# Altium project hermes.PrjPcb
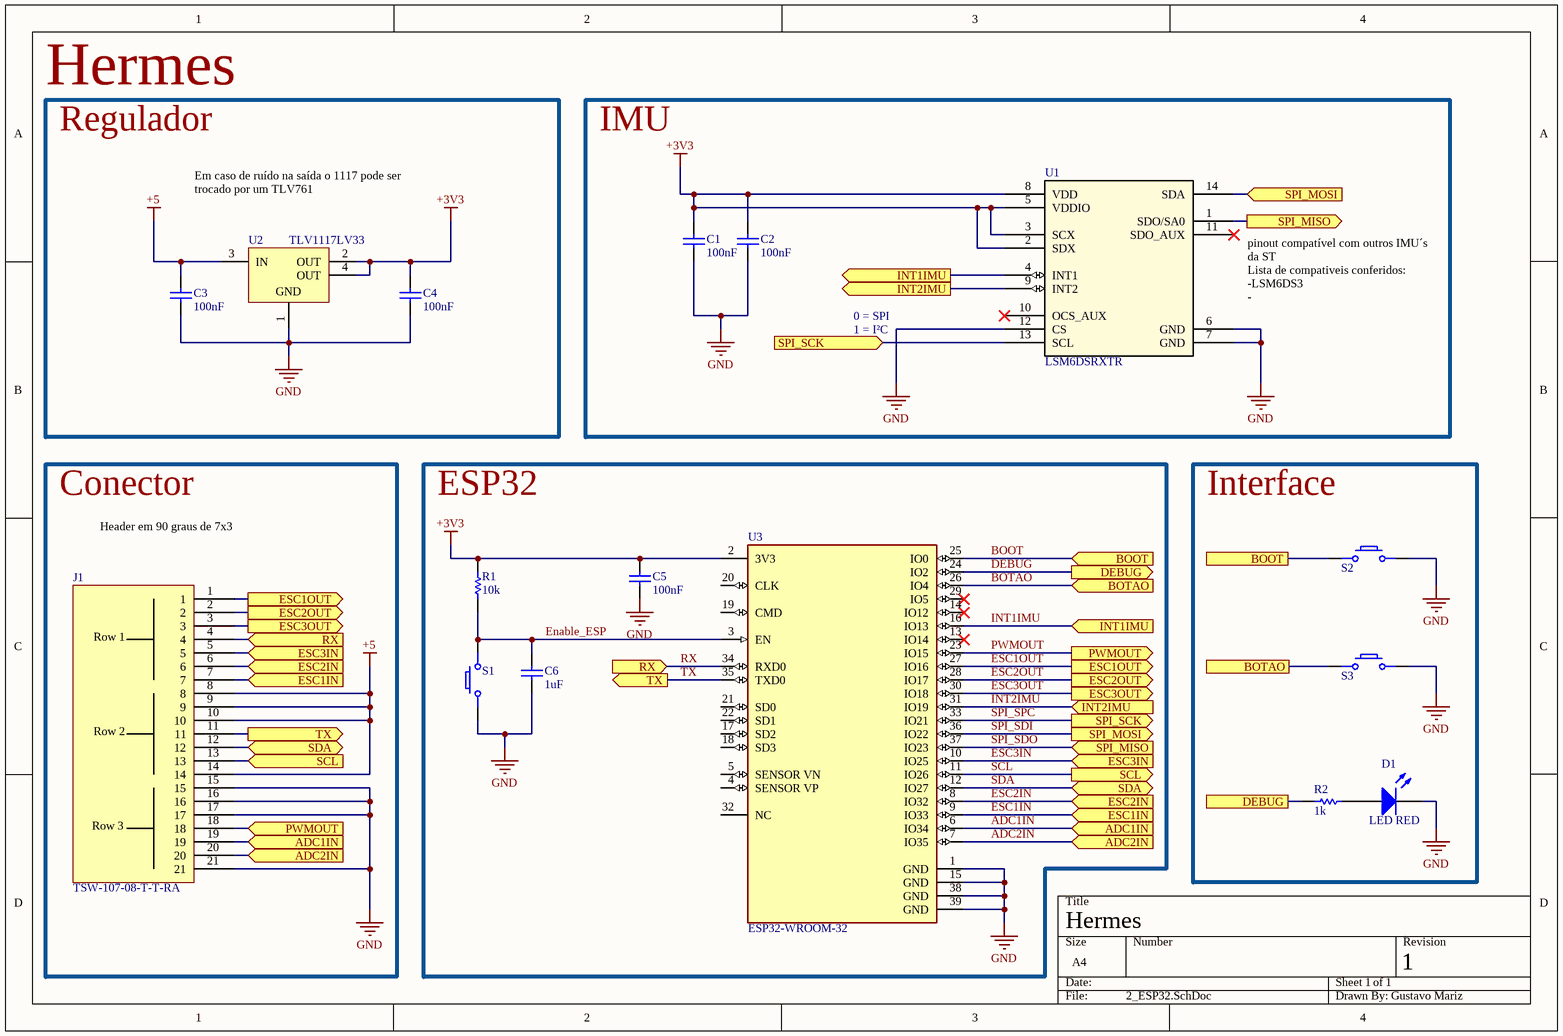
[diagram p0: 2_ESP32.SchDoc]
1 sheet, 16 parts. Net scope: flat (ports and power ports of the same name join across sheets).
Board files: hermes.PcbDoc, hermes2.PcbDoc

## Sheet 2_ESP32.SchDoc: Hermes
size A4; Date: 23/06/24; Author: Gustavo Mariz; CompanyName: Trincabotz; DrawnBy: Gustavo Mariz; DocumentNumber: 1; SheetNumber: 1; SheetTotal: 1; Time: 18:00

### Parts
C1  Valor: 100nF  [0603]  (hidden comment: CAP)
C2  Valor: 100nF  [0603]  (hidden comment: CAP)
C3  Valor: 100nF  [0603]  (hidden comment: CAP)
C4  Valor: 100nF  [0603]  (hidden comment: CAP)
C5  Valor: 100nF  [0603]  (hidden comment: CAP)
C6  Valor: 1uF  [0603]  (hidden comment: CAP)
D1  LED RED  [LED 0805]
J1  TSW-107-08-T-T-RA  [TSW-107-08-T-T-RA_SAI]
R1  value 10k  [RES 0603]  (hidden comment: RESISTOR)
R2  value 1k  [RES 0603]  (hidden comment: RESISTOR)
S1  PushButtonSMD  [PUSHBUTTON.SMD]  (value not drawn)
S2  PushButtonSMD  [PUSHBUTTON.SMD]  (value not drawn)
S3  PushButtonSMD  [PUSHBUTTON.SMD]  (value not drawn)
U1  LSM6DSRXTR  [LGA-14L_STM]
U2  TLV1117LV33  [DCY0004A_N]
U3  ESP32-WROOM-32  [FP-ESP32-WROOM-32-MFG]

### Blocks framed on the sheet
Hermes: C3 C4 U2
IMU: C1 C2 U1
Conector: J1
ESP32: C5 C6 R1 S1 U3
Interface: D1 R2 S2 S3

### Ports
ADC1IN (in, see 2_ESP32[1D]), ADC1IN (in, see 2_ESP32[3D]), ADC2IN (in, see 2_ESP32[1D]), ADC2IN (in, see 2_ESP32[3D]), BOOT (in, see 2_ESP32[4C]), BOOT (see 2_ESP32[3C]), BOTAO (in, see 2_ESP32[4C]), BOTAO (see 2_ESP32[3C]), DEBUG (out, see 2_ESP32[4D]), DEBUG (see 2_ESP32[3C]), ESC1IN (in, see 2_ESP32[1C]), ESC1IN (in, see 2_ESP32[3D]), ESC1OUT (out, see 2_ESP32[1C]), ESC1OUT (out, see 2_ESP32[3C]), ESC2IN (in, see 2_ESP32[1C]), ESC2IN (in, see 2_ESP32[3D]), ESC2OUT (out, see 2_ESP32[1C]), ESC2OUT (out, see 2_ESP32[3C]), ESC3IN (in, see 2_ESP32[1C]), ESC3IN (in, see 2_ESP32[3C]), ESC3OUT (out, see 2_ESP32[1C]), ESC3OUT (out, see 2_ESP32[3C]), INT1IMU (in, see 2_ESP32[3B]), INT1IMU (out, see 2_ESP32[3C]), INT2IMU (in, see 2_ESP32[3B]), INT2IMU (out, see 2_ESP32[3C]), PWMOUT (in, see 2_ESP32[3C]), PWMOUT (out, see 2_ESP32[1D]), RX (in, see 2_ESP32[1C]), RX (in, see 2_ESP32[2C]), SCL (in, see 2_ESP32[3D]), SCL (out, see 2_ESP32[1C]), SDA (bidir, see 2_ESP32[1C]), SDA (bidir, see 2_ESP32[3D]), SPI_MISO (in, see 2_ESP32[4A]), SPI_MISO (out, see 2_ESP32[3C]), SPI_MOSI (in, see 2_ESP32[3C]), SPI_MOSI (out, see 2_ESP32[4A]), SPI_SCK (in, see 2_ESP32[3C]), SPI_SCK (out, see 2_ESP32[2B]), TX (out, see 2_ESP32[1C]), TX (out, see 2_ESP32[2C])

### Nets
+3V3: C1.2 C2.2 C4.2 C5.2 R1.2 U1.2(SDX) U1.3(SCX) U1.5(VDDIO) U1.8(VDD) U2.2(OUT) U2.4(OUT) U3.2(3V3)
+5: C3.2 J1.8 J1.9 J1.10 J1.14 U2.3(IN)
GND: C1.1 C2.1 C3.1 C4.1 C5.1 C6.1 D1.2(K) J1.15 J1.16 J1.17 J1.21 S1.2 S2.2 S3.2 U1.6(GND) U1.7(GND) U1.12(CS) U2.1(GND) U3.1(GND) U3.15(GND) U3.38(GND) U3.39(GND)
ADC1IN: J1.19 U3.6(IO34) ; port ADC1IN
ADC2IN: J1.20 U3.7(IO35) ; port ADC2IN
BOOT: S2.1 U3.25(IO0) ; port BOOT
BOTAO: S3.1 U3.26(IO4) ; port BOTAO
DEBUG: R2.2 U3.24(IO2) ; port DEBUG
Enable_ESP: C6.2 R1.1 S1.1 U3.3(EN)
ESC1IN: J1.7 U3.9(IO33) ; port ESC1IN
ESC1OUT: J1.1 U3.27(IO16) ; port ESC1OUT
ESC2IN: J1.6 U3.8(IO32) ; port ESC2IN
ESC2OUT: J1.2 U3.28(IO17) ; port ESC2OUT
ESC3IN: J1.5 U3.10(IO25) ; port ESC3IN
ESC3OUT: J1.3 U3.30(IO18) ; port ESC3OUT
INT1IMU: U1.4(INT1) U3.16(IO13) ; port INT1IMU
INT2IMU: U1.9(INT2) U3.31(IO19) ; port INT2IMU
PWMOUT: J1.18 U3.23(IO15) ; port PWMOUT
RX: J1.4 U3.34(RXD0) ; port RX
SCL: J1.13 U3.11(IO26) ; port SCL
SDA: J1.12 U3.12(IO27) ; port SDA
SPI_SDI: U1.14(SDA) U3.36(IO22) ; port SPI_MOSI
SPI_SDO: U1.1(SDO/SA0) U3.37(IO23) ; port SPI_MISO
SPI_SPC: U1.13(SCL) U3.33(IO21) ; port SPI_SCK
TX: J1.11 U3.35(TXD0) ; port TX
NetD1_1: D1.1(A) R2.1

Not connected (* = marked no-connect by the designer): U1 10(OCS_AUX)* 11(SDO_AUX)*; U3 4(SENSOR_VP) 5(SENSOR_VN) 13(IO14)* 14(IO12)* 17(SD2) 18(SD3) 19(CMD) 20(CLK) 21(SD0) 22(SD1) 29(IO5)* 32(NC)

### Notes on the sheet
- Regulador
- (near U2) Em caso de ruído na saída o 1117 pode ser trocado por um TLV761
- pinout compatível com outros IMU´s da ST
  Lista de compativeis conferidos:
  -LSM6DS3
  -
- 0 = SPI
- 1 = I²C
- (near J1) Header em 90 graus de 7x3
- 1
- (in symbol TSW-107-08-T-T-RA) Row 1; Row 2; Row 3

### Library data of the parts
C1-C6 = CAP. CERÂMICO: Capacitor; Criador por: Luigi Eduardo; Pertence a: Trincabotz; Criado em: 26/06/2012
D1 = LED
J1 = TSW-107-08-T-T-RA: No Description Available; Mfr_Name: Samtec Inc; RefDes: RefDes; Type: Type
U1 = LSM6DSRXTR: No Description Available; Mfr_Name: STMicroelectronics; RefDes: RefDes; Type: Type
U2 = CMP-0395-00503-2: Single Output LDO, 1 A, Fixed 3.3 V Output, 2 to 5.5 V Input, 4-pin SOT-223 (DCY), -40 to 125 degC, Green (RoHS & no Sb/Br); Manufacturer: Texas Instruments; PartNumber: TLV1117LV33DCYR; Vout Adj(Min)(V): 3.3; Vdo(Typ)(mV): 1200; Iq(Typ)(mA): 0.05; Accuracy(%): 2; Iout(Max)(A): 1; SubFamily: Single Channel LDO; Vin(Max)(V): 5.5; PackageReference: DCY0004A; PackageDescription: 4-Pin Plastic Small Outline, Body 3.5 x 6.5 mm, Pitch 2.3 mm; Vout Adj(Max)(V): 3.3; Mounting Technology: Surface Mount; ComponentLink2Description: Datasheet; ComponentLink1Description: Manufacturer URL; ComponentLink3Description: Package Specification; ComponentLink1URL: http://www.ti.com/; ComponentLink2URL: http://www.ti.com/general/docs/lit/getliterature.tsp?genericPartNumber=TLV1117LV33&fileType=pdf; Fixed Output Options(V): 3.3; PackageVersion: 4202506/B; Vin(Min)(V): 2; DatasheetVersion: SBVS160A; Eco-Plan: Green (RoHS & no Sb/Br); ComponentLink3URL: http://www.ti.com/litv/pdf/mpds094a; Code_JEDEC: TO-261
U3 = CMP-194065-000008-1: RX TXRX MOD WIFI SURFACE MOUNT; Frequency: 2.5GHz; Sensitivity: -98dBm; Operating Supply Voltage: 3.6V; Data Rate: 150Mbps; Weight: 0.088185oz; Package Quantity: 550; Min Operating Temperature: -40°C; Mount: Surface Mount; Max Operating Temperature: 85°C; Packaging: Cut Tape; Case/Package: SMD/SMT